# EAGLE design IOP_1_2 (EAGLE 8.3.2)
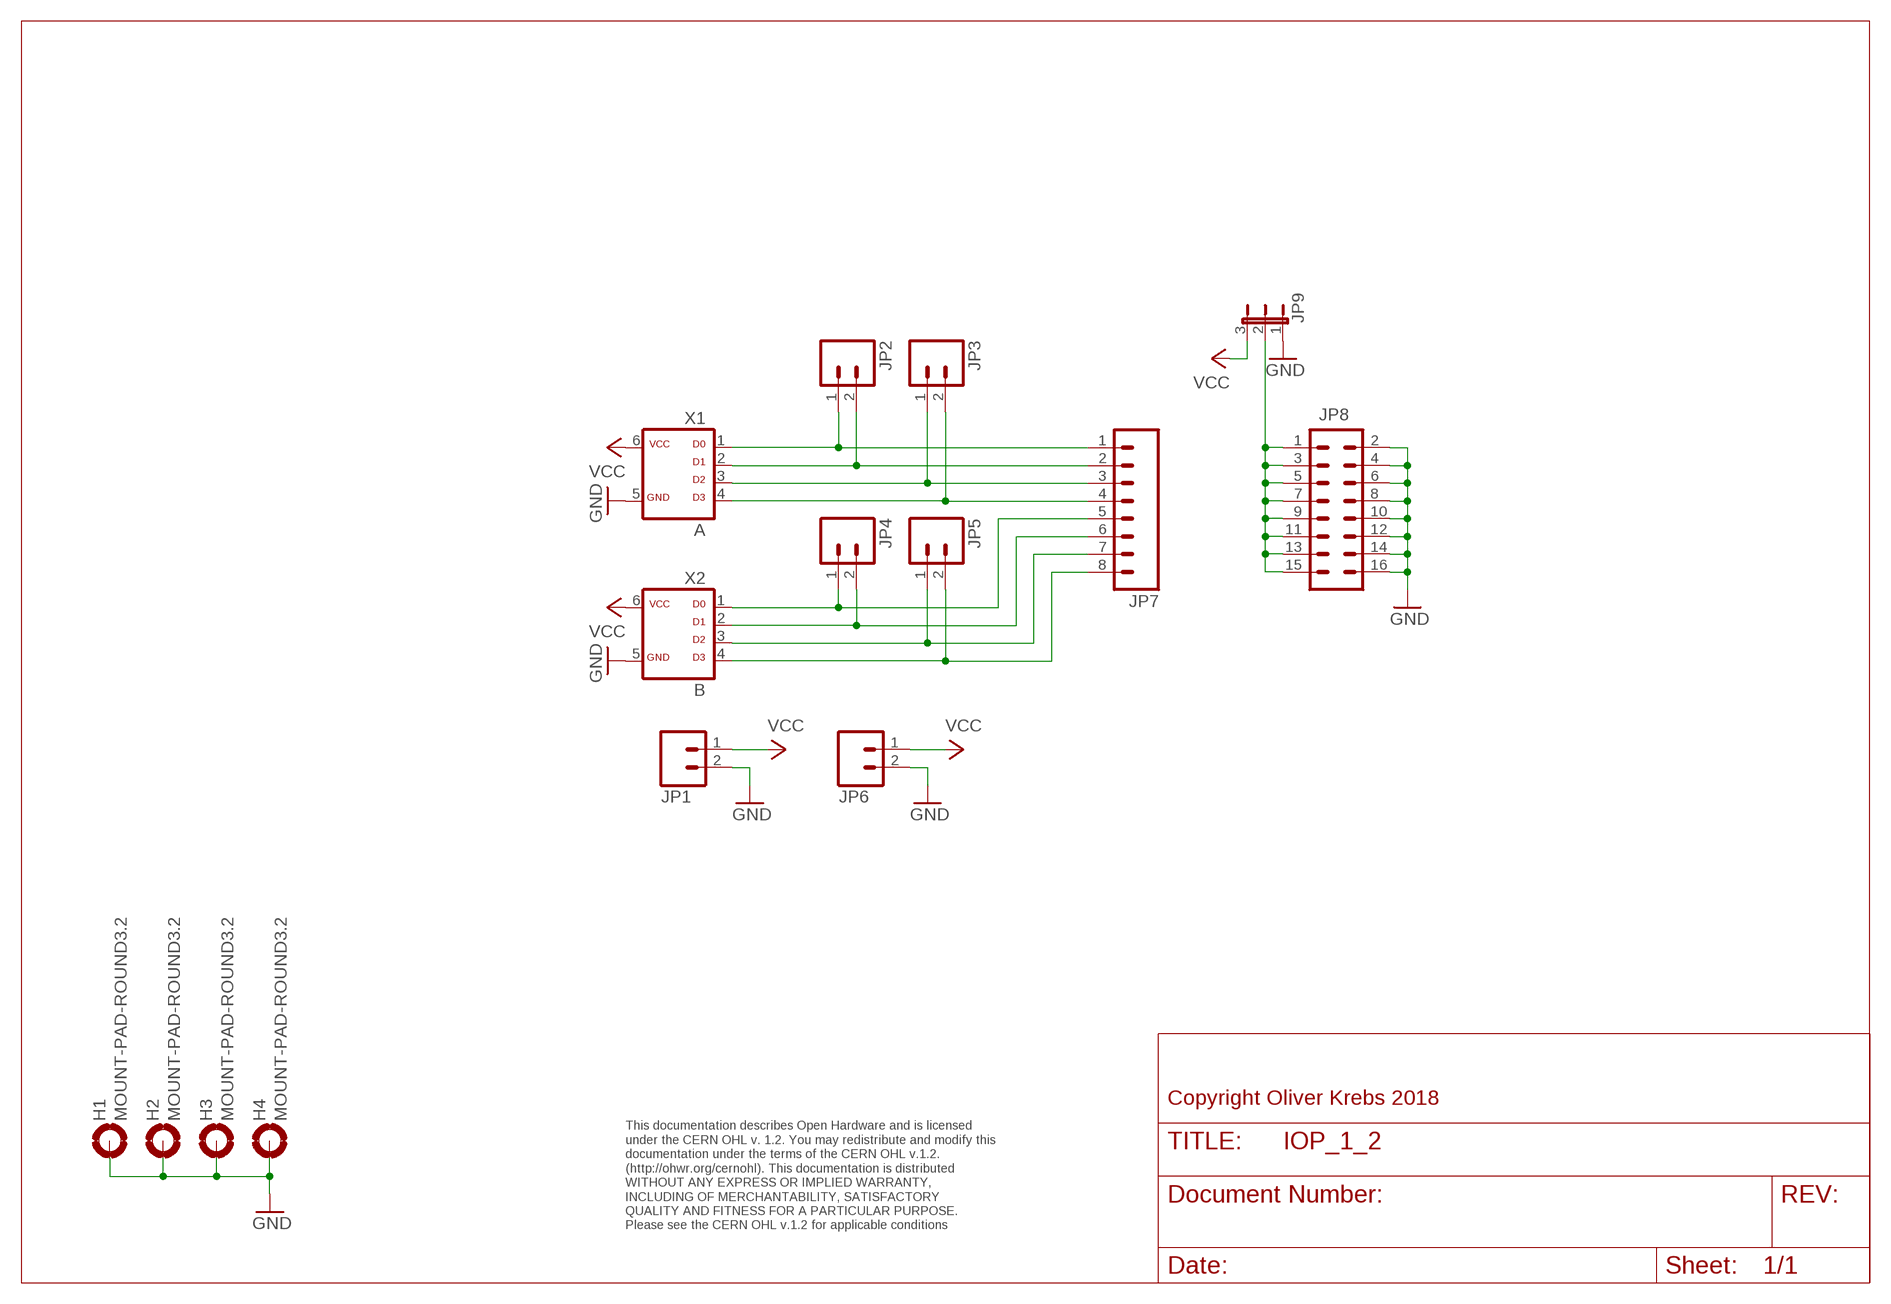
[diagram p0: schematic, sheet 1]

## Parts
H1  MOUNT-PAD-ROUND3.2  [3,2-PAD]
H2  MOUNT-PAD-ROUND3.2  [3,2-PAD]
H3  MOUNT-PAD-ROUND3.2  [3,2-PAD]
H4  MOUNT-PAD-ROUND3.2  [3,2-PAD]
JP1  M021.3MM-5.08  [1X02_BIG_5.08]
JP2  M021.3MM-5.08  [1X02_BIG_5.08]
JP3  M021.3MM-5.08  [1X02_BIG_5.08]
JP4  M021.3MM-5.08  [1X02_BIG_5.08]
JP5  M021.3MM-5.08  [1X02_BIG_5.08]
JP6  M021.3MM-5.08  [1X02_BIG_5.08]
JP7  M08  [1X08_ROUND]
JP8  M08X2  [2X8]
JP9  JP2EJP2-U  [JP2-U]
X1  A  ML6D  [ML-6]
X2  B  ML6D  [ML-6]

## Nets
GND: H1.B3,2(MOUNT) H2.B3,2(MOUNT) H3.B3,2(MOUNT) H4.B3,2(MOUNT) JP1.2 JP6.2 JP8.2 JP8.4 JP8.6 JP8.8 JP8.10 JP8.12 JP8.14 JP8.16 JP9.1 X1.5 X2.5
N$1: JP2.2 JP7.2 X1.2
N$2: JP2.1 JP7.1 X1.1
N$3: JP3.1 JP7.3 X1.3
N$4: JP3.2 JP7.4 X1.4
N$5: JP8.1 JP8.3 JP8.5 JP8.7 JP8.9 JP8.11 JP8.13 JP8.15 JP9.2
N$7: JP5.1 JP7.7 X2.3
N$8: JP5.2 JP7.8 X2.4
N$11: JP4.1 JP7.5 X2.1
N$12: JP4.2 JP7.6 X2.2
VCC: JP1.1 JP6.1 JP9.3 X1.6 X2.6

## Notes on the sheet
- Copyright Oliver Krebs 2018
- This documentation describes Open Hardware and is licensed 
  under the CERN OHL v. 1.2. You may redistribute and modify this 
  documentation under the terms of the CERN OHL v.1.2. 
  (http://ohwr.org/cernohl). This documentation is distributed
  WITHOUT ANY EXPRESS OR IMPLIED WARRANTY, 
  INCLUDING OF MERCHANTABILITY, SATISFACTORY 
  QUALITY AND FITNESS FOR A PARTICULAR PURPOSE. 
  Please see the CERN OHL v.1.2 for applicable conditions

## Library data of the parts
H1-H4 = holes:MOUNT-PAD-ROUND: MOUNTING PAD, round
JP1-JP6 = SparkFun-Connectors:M02: Standard 2-pin 0.1" header. Use with - straight break away headers ( PRT-00116) - right angle break away headers (PRT-00553) - swiss pins (PRT-00743) - machine pins (PRT-00117) - female headers (PRT-00115) Molex polarized connector foot print use with: PRT-08233 with associated crimp pins and housings. 2.54_SCREWTERM for use with PRT-10571. 3.5mm Screw Terminal footprints for PRT-08084 5mm Screw Terminal footprints for use with PRT-08432
JP7 = SparkFun-Connectors:M08: Header 8 Standard 8-pin 0.1" header. Use with straight break away headers (SKU : PRT-00116), right angle break away headers (PRT-00553), swiss pins (PRT-00743), machine pins (PRT-00117), and female headers (PRT-00115).
JP8 = SparkFun-Connectors:M08X2: .1" headers, two rows of 8 each
JP9 = 01-my-jumper:JP2E: JUMPER
X1 X2 = 01-my-con:ML6D

## Board
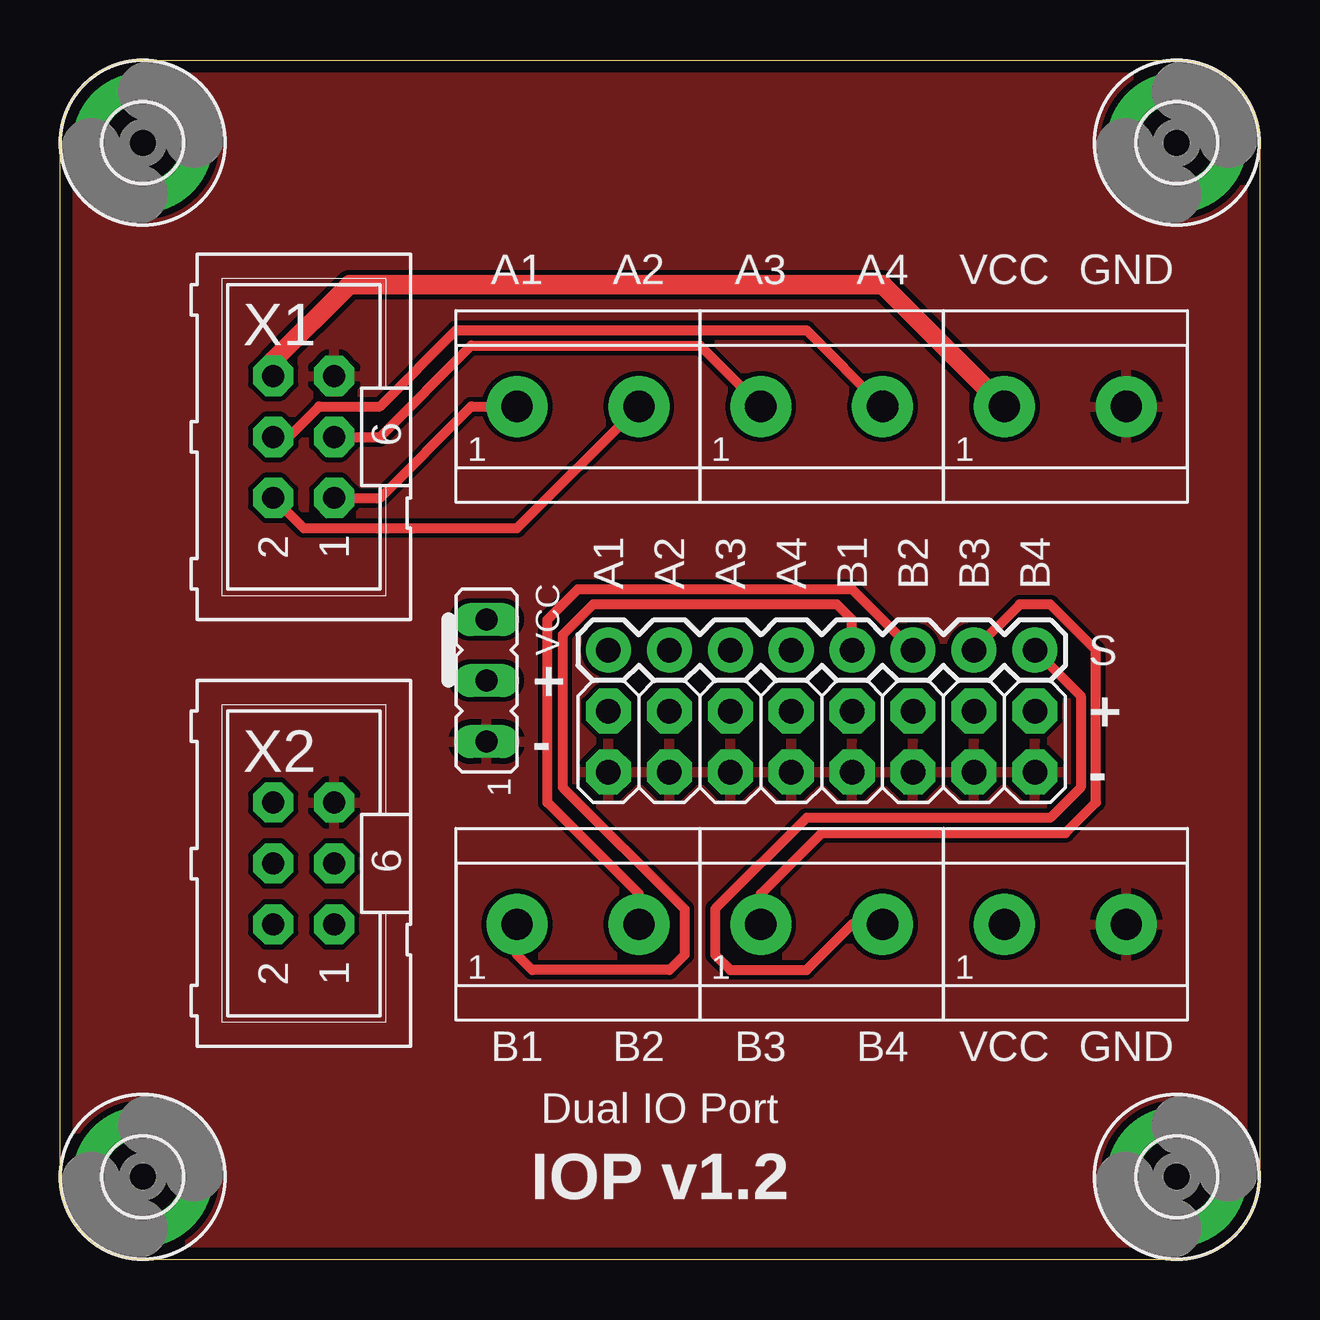
[diagram p1: board, top side]
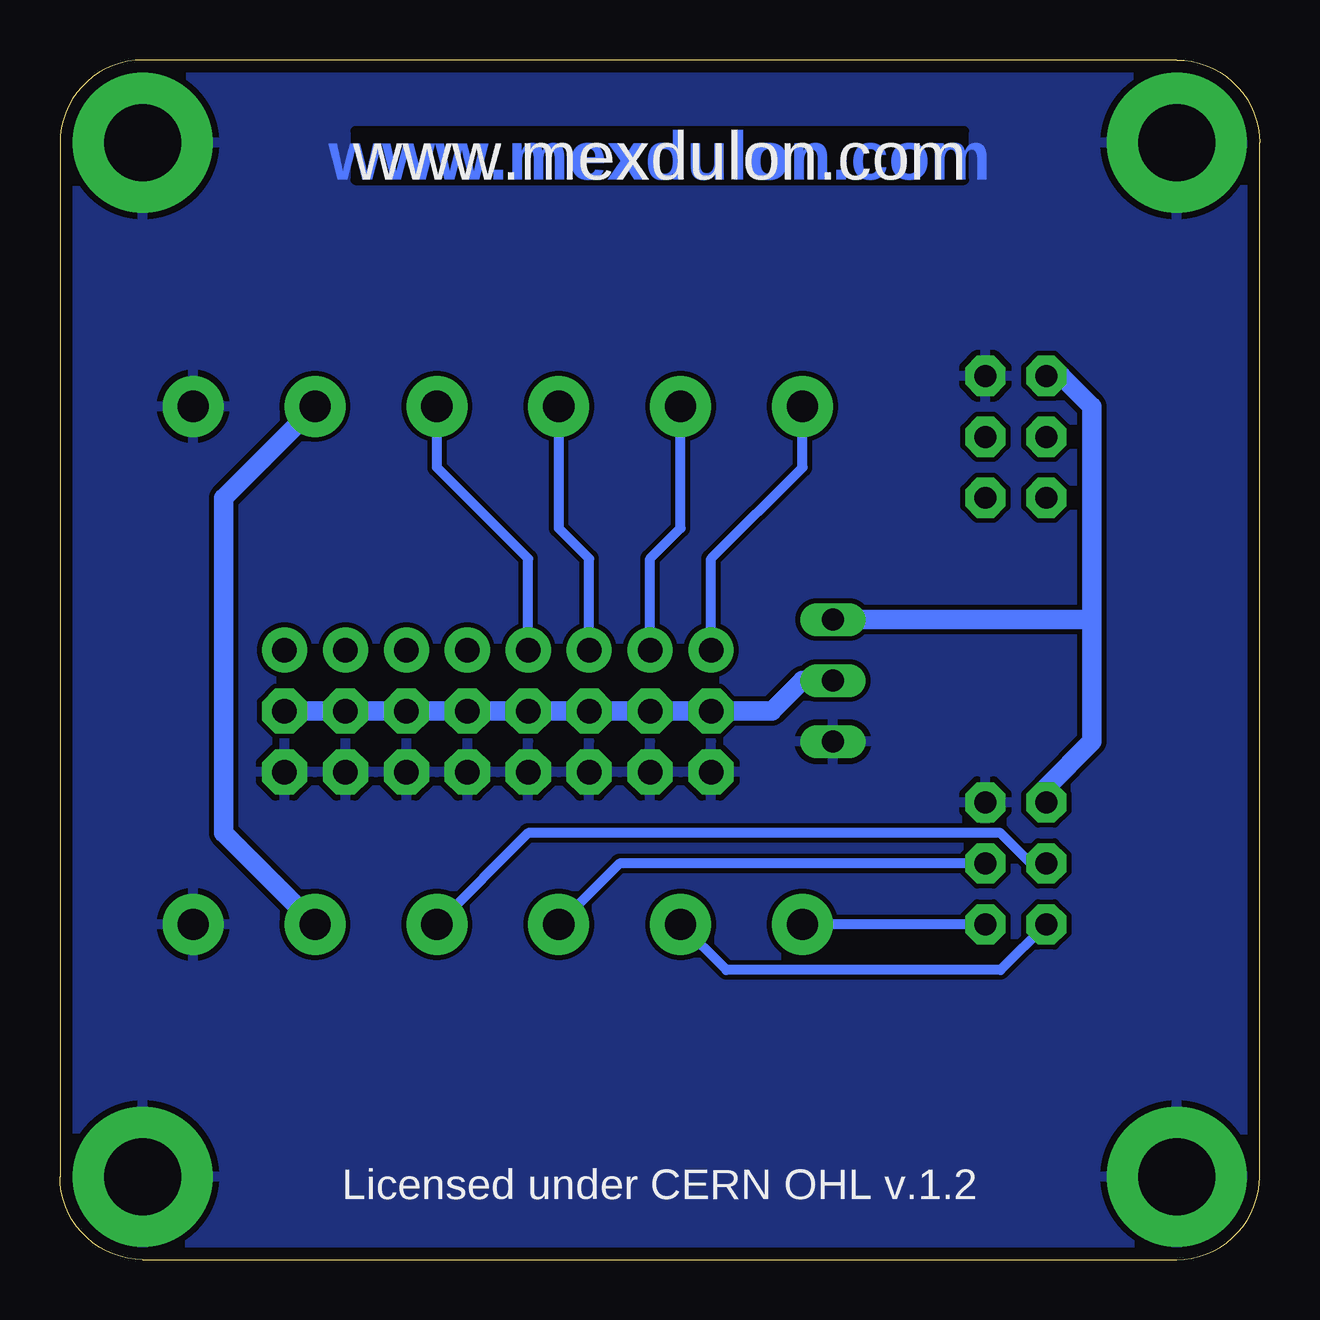
[diagram p2: board, bottom side, seen from below]

Size 50 x 50 mm. Coordinates in mm from the lower left corner, seen from the top.
Outline: 0,3.45 0,46.55 arc-90 3.45,50 46.55,50 arc-90 50,46.55 50,3.45 arc-90 46.55,0 3.45,0 arc-90 0,3.45
Copper layers (1*16): Top 0.035mm / dielectric 1.6mm / Bottom 0.035mm
Design rules "Elecrow_2-layer_PCB_eagle_rule_8mil": minimum track width 8mil, minimum drill 12mil, track to track 8mil, track to pad 8mil, pad to pad 8mil, via to via 8mil, smd to smd 0mil, copper to edge 20mil, drill to drill 10mil, minimum pad ring 6mil, minimum via ring 6mil, stop-mask expansion 0mil, vias tented up to drill 100mil, thermal gap 10mil

### Footprints (pad centres in the part's own frame; a part is rotated, then mirrored left to right if it is on the bottom)
3,2-PAD = drill 3.2 pad 5.842: B3,2 0,0
1X02_BIG_5.08 = drill 1.3 pad 2.54: 1 -2.54,0; 2 2.54,0
1X08_ROUND = drill 1.016 pad 1.88: 1 0,0; 2 2.54,0; 3 5.08,0; 4 7.62,0; 5 10.16,0; 6 12.7,0; 7 15.24,0; 8 17.78,0
2X8 = drill 1.016 pad 1.88 octagon: 1 0,0; 2 0,2.54; 3 2.54,0; 4 2.54,2.54; 5 5.08,0; 6 5.08,2.54; 7 7.62,0; 8 7.62,2.54; 9 10.16,0; 10 10.16,2.54; 11 12.7,0; 12 12.7,2.54; 13 15.24,0; 14 15.24,2.54; 15 17.78,0; 16 17.78,2.54
JP2-U = drill 0.914 long: 1 -2.54,0; 2 0,0; 3 2.54,0
ML-6 = drill 0.914 pad 1.676 octagon: 1 -2.54,-1.27; 2 -2.54,1.27; 3 0,-1.27; 4 0,1.27; 5 2.54,-1.27; 6 2.54,1.27

### Placement (x,y rotation side)
H1  3.45,3.45 0 top
H2  3.45,46.55 0 top
H3  46.55,3.45 0 top
H4  46.55,46.55 0 top
JP1  41.91,35.56 0 top
JP2  21.59,35.56 0 top
JP3  31.75,35.56 0 top
JP4  21.59,13.97 0 top
JP5  31.75,13.97 0 top
JP6  41.91,13.97 0 top
JP7  22.86,25.4 0 top
JP8  40.64,22.86 180 top
JP9  17.78,24.13 90 top
X1  10.16,34.29 90 top
X2  10.16,16.51 90 top

### Tracks (layer width: path | path; a pad name or v marks a point on that pad's centre or on a via)
GND
  pour Bottom: 0,0 50.8,0 50.8,50.8 0,50.8
  pour Top: 0,50.16 50.16,50.16 50.16,0 0,0
N$1
  Top 0.406: X1.2 10.16,30.48 19.05,30.48 JP2.2
  Bottom 0.406: JP7.2 25.4,29.21 24.13,30.48 JP2.2
N$2
  Top 0.406: X1.1 13.34,31.75 17.14,35.56 JP2.1
  Bottom 0.406: JP7.1 22.86,29.21 19.05,33.02 JP2.1
N$3
  Top 0.406: X1.3 13.34,34.29 17.14,38.1 26.67,38.1 JP3.1
  Bottom 0.406: JP7.3 27.94,29.21 29.21,30.48 JP3.1
N$4
  Top 0.406: X1.4 9.53,34.29 10.79,35.56 13.34,35.56 16.51,38.73 31.11,38.73 JP3.2
  Bottom 0.406: JP7.4 30.48,29.21 34.29,33.02 JP3.2
N$5
  Bottom 0.813: JP8.1 JP8.3 JP8.5 JP8.7 JP8.9 JP8.11 JP8.13 JP8.15 20.32,22.86 19.05,24.13 JP9.2
N$7
  Top 0.406: JP5.1 29.21,15.24 31.75,17.78 41.91,17.78 43.18,19.05 43.18,25.4 41.27,27.3 40.01,27.3 JP7.7
  Bottom 0.406: X2.3 26.67,16.51 JP5.1
N$8
  Top 0.406: JP7.8 42.55,23.5 42.55,19.68 41.27,18.41 31.11,18.41 27.3,14.61 27.3,12.7 27.94,12.06 31.11,12.06 33.02,13.97 JP5.2
  Bottom 0.406: X2.4 9.53,16.51 10.79,17.78 30.48,17.78 JP5.2
N$11
  Top 0.406: JP7.5 33.02,26.67 32.38,27.3 22.23,27.3 20.95,26.04 20.95,19.68 26.04,14.61 26.04,12.7 25.4,12.06 19.68,12.06 19.05,12.7 JP4.1
  Bottom 0.406: X2.1 JP4.1
N$12
  Top 0.406: JP4.2 24.13,15.24 20.32,19.05 20.32,26.67 21.59,27.94 33.02,27.94 JP7.6
  Bottom 0.406: X2.2 10.79,12.06 22.23,12.06 JP4.2
VCC
  Top 0.813: JP1.1 34.29,40.64 12.06,40.64 8.89,37.47 X1.6
  Bottom 0.61: X1.6 8.26,36.83
  Bottom 0.813: X2.6 8.89,19.68 6.99,21.59 6.99,26.67 | 8.26,36.83 6.99,35.56 6.99,26.67 | JP1.1 43.18,31.75 43.18,17.78 JP6.1 | JP9.3 6.99,26.67

### Text on the board
Bottom: www.mexdulon.com
tNames: A1 | A2 | A3 | A4 | VCC | GND | A1 | A2 | A3 | A4 | B1 | B2 | B3 | B4 | VCC | S | + | + | - | - | B1 | B2 | B3 | B4 | VCC | GND | Dual IO Port | IOP v1.2
bNames: www.mexdulon.com | Licensed under CERN OHL v.1.2